# Altium schematic sheet Master MicroController Core.SchDoc: Master MicroController Core
size 393 x 281 mm; DocumentNumber: 15; SheetNumber: 17; SheetTotal: 42
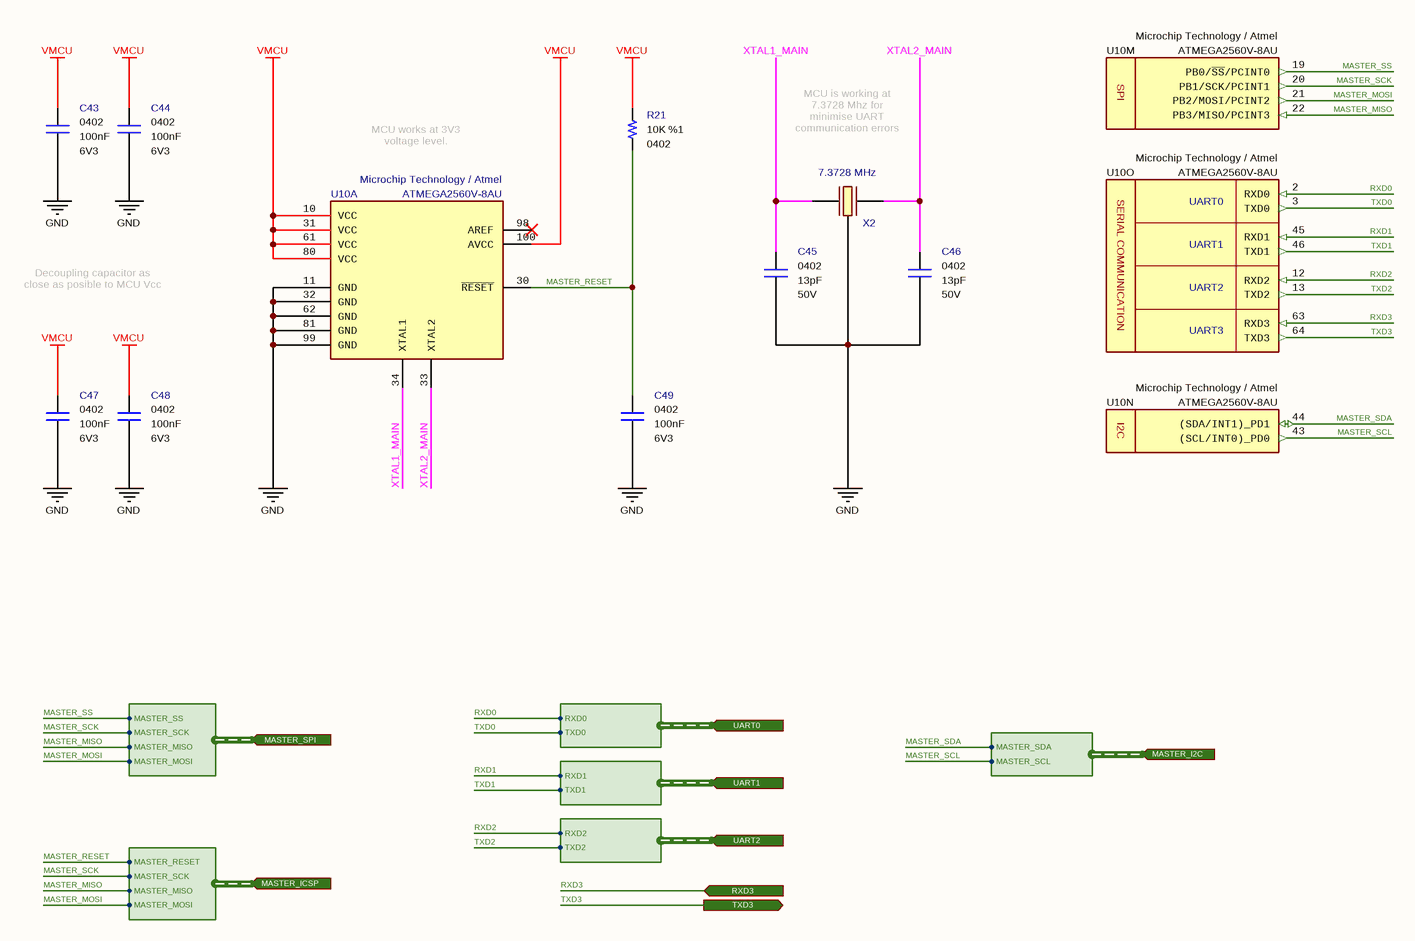
[diagram p0: Master MicroController Core.SchDoc]

## Parts
C43  value 100nF  Case: 0402  Voltage: 6V3  [CAPACITOR_0402]  (hidden comment: Multilayer Ceramic Capacitor)
C44  value 100nF  Case: 0402  Voltage: 6V3  [CAPACITOR_0402]  (hidden comment: Multilayer Ceramic Capacitor)
C45  value 13pF  Voltage: 50V  Case: 0402  [CAPACITOR_0402]  (hidden comment: Multilayer Ceramic Capacitor)
C46  value 13pF  Voltage: 50V  Case: 0402  [CAPACITOR_0402]  (hidden comment: Multilayer Ceramic Capacitor)
C47  value 100nF  Case: 0402  Voltage: 6V3  [CAPACITOR_0402]  (hidden comment: Multilayer Ceramic Capacitor)
C48  value 100nF  Case: 0402  Voltage: 6V3  [CAPACITOR_0402]  (hidden comment: Multilayer Ceramic Capacitor)
C49  value 100nF  Case: 0402  Voltage: 6V3  [CAPACITOR_0402]  (hidden comment: Multilayer Ceramic Capacitor)
R21  value 10K  Tolerance: %1  Case: 0402  [RESISTOR_0402]  (hidden comment: Thick Film Resistor)
U10  Manufacturer Part Number: ATMEGA2560V-8AU  Manufacturer Name: Microchip Technology / Atmel  [TQFP100]  (hidden comment: 8-bit MicroController)  (parts A,M,N,O of 15)
X2  7.3728 MHz  [ABRACON_CRYSTAL]

## Ports
MASTER_I2C (in, harness MASTER_I2C), MASTER_ICSP (in, harness MASTER_ICSP), MASTER_SPI (in, harness MASTER_SPI), RXD3 (in), TXD3 (out), UART0 (in, harness UART0), UART1 (in, harness UART1), UART2 (in, harness UART2)

## Harnesses
MASTER_ICSP: MASTER_MOSI, MASTER_MISO, MASTER_SCK, MASTER_RESET
MASTER_SPI: MASTER_MOSI, MASTER_MISO, MASTER_SCK, MASTER_SS
UART0: RXD0, TXD0
UART1: RXD1, TXD1
UART2: RXD2, TXD2
MASTER_I2C: MASTER_SDA, MASTER_SCL

## Nets
GND: C43.1 C44.1 C45.1 C46.1 C47.1 C48.1 C49.1 U10.11(GND) U10.32(GND) U10.62(GND) U10.81(GND) U10.99(GND) X2.2(GND)
VMCU: C43.2 C44.2 C47.2 C48.2 R21.2 U10.10(VCC) U10.31(VCC) U10.61(VCC) U10.80(VCC) U10.100(AVCC)
MASTER_MISO: U10.22(PB3/MISO/PCINT3) ; port MASTER_ICSP.MASTER_MISO, port MASTER_SPI.MASTER_MISO
MASTER_MOSI: U10.21(PB2/MOSI/PCINT2) ; port MASTER_ICSP.MASTER_MOSI, port MASTER_SPI.MASTER_MOSI
MASTER_RESET: C49.2 R21.1 U10.30(~{RESET}) ; port MASTER_ICSP.MASTER_RESET
MASTER_SCK: U10.20(PB1/SCK/PCINT1) ; port MASTER_ICSP.MASTER_SCK, port MASTER_SPI.MASTER_SCK
MASTER_SCL: U10.43((SCL/INT0)_PD0) ; port MASTER_I2C.MASTER_SCL
MASTER_SDA: U10.44((SDA/INT1)_PD1) ; port MASTER_I2C.MASTER_SDA
MASTER_SS: U10.19(PB0/~{SS}/PCINT0) ; port MASTER_SPI.MASTER_SS
RXD0: U10.2(RXD0) ; port UART0.RXD0
RXD1: U10.45(RXD1) ; port UART1.RXD1
RXD2: U10.12(RXD2) ; port UART2.RXD2
RXD3: U10.63(RXD3) ; port RXD3
TXD0: U10.3(TXD0) ; port UART0.TXD0
TXD1: U10.46(TXD1) ; port UART1.TXD1
TXD2: U10.13(TXD2) ; port UART2.TXD2
TXD3: U10.64(TXD3) ; port TXD3
XTAL1_MAIN: C45.2 U10.34(XTAL1) X2.3(OUT/IN)
XTAL2_MAIN: C46.2 U10.33(XTAL2) X2.1(IN/OUT)

Not connected (* = marked no-connect by the designer): U10 98(AREF)*; X2 4(GND)

## Notes on the sheet
- MCU works at 3V3 voltage level.
- MCU is working at 7.3728 Mhz for minimise UART communication errors (115200bps).
- Decoupling capacitor as close as posible to MCU Vcc pins.
- © 2021 All rights reserved.
  This document may not, in whole or in part, be copied, photocopied, reproduced, translated or converted to any electronic or machine readable from without prior written permission of Mehmet Günce Akkoyun.
  Engineer contact : akkoyun@me.com
- Property of
- Engineer :
- Date :
- Size :
- A3
- Time :
- Project :
- Page :
- /
- Customer :
- Product ID :
- Module ID :
- Version :
- File :
- Revision :
- (in symbol IC - ATMEGA2560V-8AU, part M) SPI
- (in symbol IC - ATMEGA2560V-8AU, part N) I2C
- (in symbol IC - ATMEGA2560V-8AU, part O) UART0; UART1; SERIAL COMMUNICATION; UART2; UART3

## Library data of the parts
C43 C44 C47-C49 = Capacitor - 100nF [0402-6V3]: Capacitor - 100nF [0402-6V3] (Ceramic); Manufacturer Name: AVX; Manufacturer Part Number: 04026D104KAT4A; Dielectric: X5R; Tolerance: %10; Height: 0.25mm; ComponentLink1Description: Mouser; ComponentLink1URL: https://www.mouser.com.tr/ProductDetail/AVX/04026D104KAT4A?qs=sGAEpiMZZMs0AnBnWHyRQPg4iYkCw7IMED%2F4kpqgf7w%3D; ComponentLink2Description: DataSheet; ComponentLink2URL: https://www.mouser.com.tr/datasheet/2/40/cx5r-776519.pdf; ROHS: Yes; Maximum Operating Temperature: +85; Minimum Operating Temperature: -55; Supplier 1: Avnet; Supplier Part Number 1: 04026D104KAT4A; Mouser Part Number: 581-04026D104KAT4A
C45 C46 = Capacitor - 13pF [0402-50V]: Capacitor - 13pF [0402] (Ceramic); Manufacturer Name: Kemet; Manufacturer Part Number: CBR04C130F5GAC; Dielectric: C0G; Tolerance: 1%; Height: 0.55mm; ROHS: Yes; Weight: 0.65mg; ComponentLink1Description: DataSheet; ComponentLink1URL: http://www.kemet.com/Lists/ProductCatalog/Attachments/490/KEM_C1030_CBR_SMD.pdf; ComponentLink2Description: Mouser; ComponentLink2URL: http://www.mouser.com/Search/ProductDetail.aspx?qs=kSX8PZDGYstn%252bRHasf81FA%3d%3d; Supplier 1: Mouser; Supplier 2: Farnell; Supplier 3: Digi-Key; Supplier Part Number 3: 399-8812-1-ND; Supplier Part Number 2: 2773390; Supplier Part Number 1: 80-CBR04C130F5GAC; Mouser Part Number: 80-CBR04C130F5GAC
R21 = Resistor - 10K: Thick Film Resistors - SMD 1/16 W 10 Kohms 1%; Manufacturer Name: Vishay; Manufacturer Part Number: CRCW040210K0FKED; Height: 0.4mm; ComponentLink1Description: DataSheet; ComponentLink1URL: https://www.mouser.com.tr/datasheet/2/427/dcrcwe3-1762152.pdf; ComponentLink2Description: Mouser; ComponentLink2URL: https://www.mouser.com.tr/ProductDetail/Vishay-Dale/CRCW040210K0FKED?qs=sGAEpiMZZMu61qfTUdNhG2DpbjADlD3GcalbOv9utCY%3D; Supplier 1: Mouser; Supplier 2: Digi-Key; Supplier Part Number 1: 71-CRCW040210K0FKEDH; Supplier Part Number 2: 541-10.0KYCT-ND; Mouser Part Number: 71-CRCW0402-10K-E3
U10 = IC - ATMEGA2560V-8AU: 8-bit Microcontrollers - MCU 256kB Flash 4kB EEPROM 86 I/O Pins; Supply Voltage - Min: 2V7; Supply Voltage - Max: 5.5V; Height: 1mm; ComponentLink1Description: DataSheet; ComponentLink1URL: https://eu.mouser.com/datasheet/2/268/Atmel-2549-8-bit-AVR-Microcontroller-ATmega640-128-1315286.pdf; ROHS: Yes; Minimum Operating Temperature: -40; Maximum Operating Temperature: +85; ComponentLink2Description: Mouser; ComponentLink2URL: https://eu.mouser.com/ProductDetail/Microchip-Technology-Atmel/ATMEGA2560V-8AU?qs=sGAEpiMZZMutXGli8Ay4kKlCYcvZUWqJYdtgGFyqFT8%3D; Supplier 1: Digi-Key; Supplier 2: Newark; Supplier 3: Avnet; Supplier 4: RSComponents; Supplier 5: RSComponents; Supplier Part Number 1: ATMEGA2560V-8AU-ND; Supplier Part Number 2: 68T2784; Supplier Part Number 3: 68T2784; Supplier Part Number 4: 1278284P; Supplier Part Number 5: 1278284; Case: TQFP-100; Supplier 6: Mouser; Supplier 7: Future Electronics; Supplier 8: Avnet; Supplier 9: Arrow Electronics; Supplier 10: Farnell; Supplier 11: Allied Electronics; Supplier 12: Future Electronics; Supplier 13: RSComponents; Supplier 14: RSComponents; Supplier 15: RSComponents; Supplier Part Number 6: 556-ATMEGA2560V8AU; Supplier Part Number 7: 4038198; Supplier Part Number 8: ATMEGA2560V-8AU; Supplier Part Number 9: ATMEGA2560V-8AU; Supplier Part Number 10: 1288331; Supplier Part Number 11: 70124009; Supplier Part Number 12: ATMEGA2560V-8AU-TRAY; Supplier Part Number 13: 6963424; Supplier Part Number 14: 6963424P; Supplier Part Number 15: 9220809
X2 = Crystal - 7.3728 MHz (Abracon): Crystals 7.3728MHz 18pF -40C +85C; Manufacturer Part Number: ABMM2-7.3728MHZ-E2-T; ESR: 150 Ohms; Frequency Stability: 20 ppm; Height: 1.2 mm; Manufacturer Name: ABRACON; Mouser Part Number: 815-ABMM2-7.3-E2-T; Frequency: 7.3728 MHz; Maximum Operating Temperature: +70; Minimum Operating Temperature: -20; ROHS: Yes; Tolerance: 20 ppm; ComponentLink1Description: DataSheet; ComponentLink1URL: https://www.ecsxtal.com/store/pdf/csm-8mr.pdf; ComponentLink2Description: Mouser; ComponentLink2URL: https://www.mouser.com/Search/Refine.aspx?Keyword=520-7.3-18-20BM-JENT; Supplier 1: Mouser; Supplier 2: Arrow; Supplier Part Number 2: ABMM2-7.3728MHZ-E2-T; Supplier Part Number 1: 815-ABMM2-7.3-E2-T; Case: SMD